# Altium schematic sheet [04]-BUTTON.SchDoc
size A
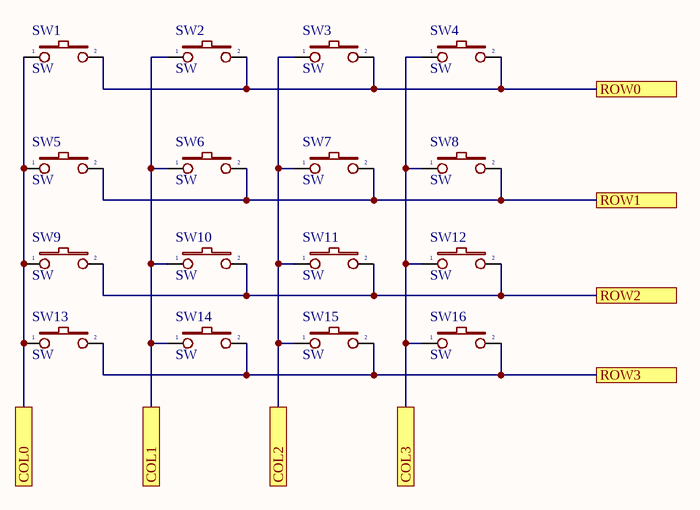
[diagram p0: [04]-BUTTON.SchDoc]

## Parts
SW1  SW  [SW-SMD]
SW2  SW  [SW-SMD]
SW3  SW  [SW-SMD]
SW4  SW  [SW-SMD]
SW5  SW  [SW-SMD]
SW6  SW  [SW-SMD]
SW7  SW  [SW-SMD]
SW8  SW  [SW-SMD]
SW9  SW  [SW-SMD]
SW10  SW  [SW-SMD]
SW11  SW  [SW-SMD]
SW12  SW  [SW-SMD]
SW13  SW  [SW-SMD]
SW14  SW  [SW-SMD]
SW15  SW  [SW-SMD]
SW16  SW  [SW-SMD]

## Ports
COL0, COL1, COL2, COL3, ROW0, ROW1, ROW2, ROW3

## Nets
COL0: SW1.1 SW5.1 SW9.1 SW13.1 ; port COL0
COL1: SW2.1 SW6.1 SW10.1 SW14.1 ; port COL1
COL2: SW3.1 SW7.1 SW11.1 SW15.1 ; port COL2
COL3: SW4.1 SW8.1 SW12.1 SW16.1 ; port COL3
ROW0: SW1.2 SW2.2 SW3.2 SW4.2 ; port ROW0
ROW1: SW5.2 SW6.2 SW7.2 SW8.2 ; port ROW1
ROW2: SW9.2 SW10.2 SW11.2 SW12.2 ; port ROW2
ROW3: SW13.2 SW14.2 SW15.2 SW16.2 ; port ROW3

## Library data of the parts
SW1-SW16 = SW2: Switch button 2 pin; Value: SW chip 2 pin